# Altium schematic sheet Led.SchDoc
size B; SheetNumber: 1; SheetTotal: 1; SPICEModelCacheJMWTMJWM: <root> / <DocumentId>JMWTMJWM</DocumentId> / <CacheFrame Number="0"> / <Model Name="1206_150120ss75000" Kind="CKT"> / <Text>****** / .subckt 1206_150120SS75000  1  2 / D1 1 2 SMCW / .MODEL SMCW D / + IS=10.012E-21 / + N=1.7421 / + RS=1.0000E-6 / + IKF=.26961 / + CJO=1.0000E-12 / + M=.3333 / + VJ=.75 / + BV=5 / + IBV=10.00E-6 / + TT=5.0000E-9 / .ends</Text> / </Model> / </CacheFrame> / </root>
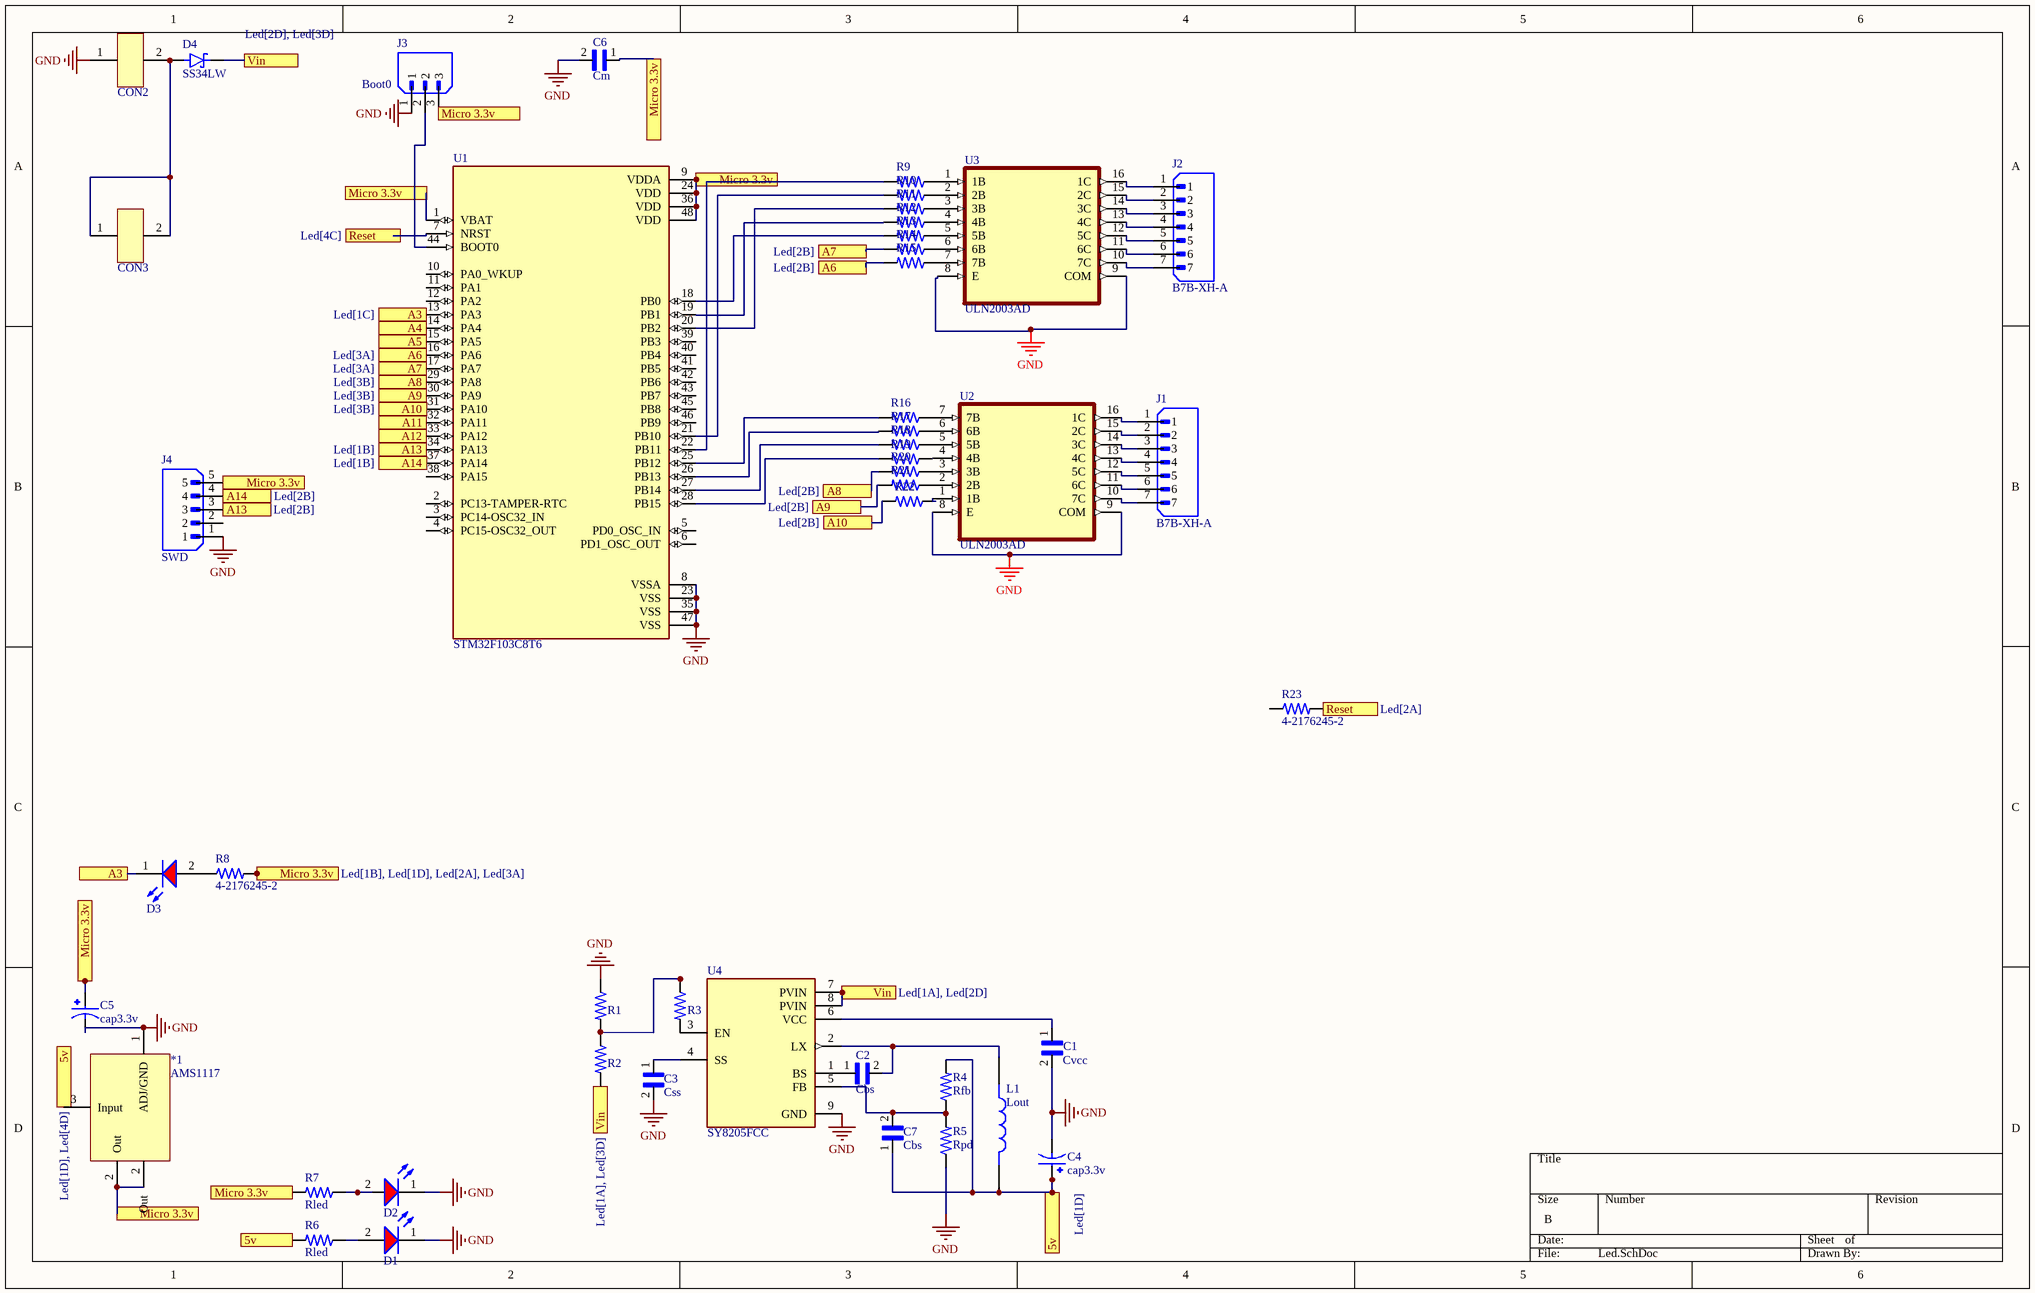
[diagram p0: Led.SchDoc]

## Parts
*1  AMS1117  [SOT229P700X180-4N]
C1  Cvcc  [CAP3216X125N]
C2  Cbs  [CAP3216X125N]
C3  Css  [CAP3216X125N]
C4  cap3.3v  [CAP_EEEFPA221XAL]
C5  cap3.3v  [CAP_EEEFPA221XAL]
C6  Cm  [CAP3216X125N]
C7  Cbs  [CAP3216X125N]
CON2  CON?  [PCBComponent_1]  (value not drawn)
CON3  CON?  [PCBComponent_1]  (value not drawn)
D1  Super Red, 1.9V, 140°  [WL-SMCW_1206_150120xx75000]  (value not drawn)
D2  Super Red, 1.9V, 140°  [WL-SMCW_1206_150120xx75000]  (value not drawn)
D3  Super Red, 1.9V, 140°  [WL-SMCW_1206_150120xx75000]  (value not drawn)
D4  SS34LW  [SODFL3718X102N]
J1  B7B-XH-A  [PCBComponent_1]
J2  B7B-XH-A  [PCBComponent_1]
J3  Boot0  [PCBComponent_1]
J4  SWD  [PCBComponent_1]
L1  Lout  [IND_LQH5BPB100MT0L]
R1  4-2176245-2  [RESC3115X65N]  (value not drawn)
R2  4-2176245-2  [RESC3115X65N]  (value not drawn)
R3  4-2176245-2  [RESC3115X65N]  (value not drawn)
R4  Rfb  [RESC3115X65N]
R5  Rpd  [RESC3115X65N]
R6  Rled  [RESC3115X65N]
R7  Rled  [RESC3115X65N]
R8  4-2176245-2  [RESC3115X65N]
R9  4-2176245-2  [PCBComponent_1]  (value not drawn)
R10  4-2176245-2  [PCBComponent_1]  (value not drawn)
R11  4-2176245-2  [PCBComponent_1]  (value not drawn)
R12  4-2176245-2  [PCBComponent_1]  (value not drawn)
R13  4-2176245-2  [PCBComponent_1]  (value not drawn)
R14  4-2176245-2  [PCBComponent_1]  (value not drawn)
R15  4-2176245-2  [PCBComponent_1]  (value not drawn)
R16  4-2176245-2  [PCBComponent_1]  (value not drawn)
R17  4-2176245-2  [PCBComponent_1]  (value not drawn)
R18  4-2176245-2  [PCBComponent_1]  (value not drawn)
R19  4-2176245-2  [PCBComponent_1]  (value not drawn)
R20  4-2176245-2  [PCBComponent_1]  (value not drawn)
R21  4-2176245-2  [PCBComponent_1]  (value not drawn)
R22  4-2176245-2  [PCBComponent_1]  (value not drawn)
R23  4-2176245-2  [PCBComponent_1]
U1  STM32F103C8T6  [QFP50P900X900X160-48N]
U2  ULN2003AD  [SOIC127P600X175-16N]
U3  ULN2003AD  [SOIC127P600X175-16N]
U4  SY8205FCC  [VREG_SY8205FCC]

## Ports
5v (see Led[1D]), 5v (see Led[1D], Led[4D]), A3 (see Led[1C]), A3 (see Led[2A]), A4, A5, A6 (see Led[2B]), A6 (see Led[3A]), A7 (see Led[2B]), A7 (see Led[3A]), A8 (see Led[2B]), A8 (see Led[3B]), A9 (see Led[2B]), A9 (see Led[3B]), A10 (see Led[2B]), A10 (see Led[3B]), A11, A12, A13 (see Led[1B]), A13 (see Led[2B]), A14 (see Led[1B]), A14 (see Led[2B]), Micro 3.3v (see Led[1B], Led[1C], Led[1D], Led[2A]), Micro 3.3v (see Led[1B], Led[1C], Led[1D], Led[2A], Led[3A]), Micro 3.3v (see Led[1B], Led[1D], Led[2A], Led[3A]), Micro 3.3v (see Led[1C], Led[1D], Led[2A], Led[3A]), Reset (see Led[2A]), Reset (see Led[4C]), Vin (see Led[1A], Led[2D]), Vin (see Led[1A], Led[3D]), Vin (see Led[2D], Led[3D])

## Nets
GND: *1.1(ADJ/GND) C1.2 C3.2 C4.2 C5.2 C6.2 CON2.1 D1.1(K) D2.1(K) J3.1 J4.1 R1.1 R5.1 U1.8(VSSA) U1.23(VSS) U1.35(VSS) U1.47(VSS) U2.8(E) U2.9(COM) U3.8(E) U3.9(COM) U4.9(GND)
5v: *1.3(Input) C4.1 C7.1 L1.2 R4.2 R6.2 ; port 5v
A3: D3.1(K) U1.13(PA3) ; port A3
A4: U1.14(PA4) ; port A4
A5: U1.15(PA5) ; port A5
A6: R15.2 U1.16(PA6) ; port A6
A7: R14.2 U1.17(PA7) ; port A7
A8: R20.2 U1.29(PA8) ; port A8
A9: R21.2 U1.30(PA9) ; port A9
A10: R22.2 U1.31(PA10) ; port A10
A11: U1.32(PA11) ; port A11
A12: U1.33(PA12) ; port A12
A13: J4.3 U1.34(PA13) ; port A13
A14: J4.4 U1.37(PA14) ; port A14
Micro 3.3v: *1.2(Out) C5.1 C6.1 J3.3 J4.5 R7.2 R8.2 U1.1(VBAT) U1.9(VDDA) U1.24(VDD) U1.36(VDD) U1.48(VDD) ; port Micro 3.3v
Reset: R23.2 U1.7(NRST) ; port Reset
Vin: D4.C(K) R2.2 U4.7(PVIN) U4.8(PVIN) ; port Vin
NetC1_1: C1.1 U4.6(VCC)
NetC2_1: C2.1 U4.1(BS)
NetC2_2: C2.2 L1.1 U4.2(LX)
NetC3_1: C3.1 U4.4(SS)
NetC7_2: C7.2 R4.1 R5.2 U4.5(FB)
NetCON2_2: CON2.2 CON3.1 CON3.2 D4.A
NetD1_2: D1.2(A) R6.1
NetD2_2: D2.2(A) R7.1
NetD3_2: D3.2(A) R8.1
NetJ1_1: J1.1 U2.16(1C)
NetJ1_2: J1.2 U2.15(2C)
NetJ1_3: J1.3 U2.14(3C)
NetJ1_4: J1.4 U2.13(4C)
NetJ1_5: J1.5 U2.12(5C)
NetJ1_6: J1.6 U2.11(6C)
NetJ1_7: J1.7 U2.10(7C)
NetJ2_1: J2.1 U3.16(1C)
NetJ2_2: J2.2 U3.15(2C)
NetJ2_3: J2.3 U3.14(3C)
NetJ2_4: J2.4 U3.13(4C)
NetJ2_5: J2.5 U3.12(5C)
NetJ2_6: J2.6 U3.11(6C)
NetJ2_7: J2.7 U3.10(7C)
NetJ3_2: J3.2 U1.44(BOOT0)
NetR1_2: R1.2 R2.1 R3.1
NetR3_2: R3.2 U4.3(EN)
NetR9_1: R9.1 U3.1(1B)
NetR9_2: R9.2 U1.22(PB11)
NetR10_1: R10.1 U3.2(2B)
NetR10_2: R10.2 U1.21(PB10)
NetR11_1: R11.1 U3.3(3B)
NetR11_2: R11.2 U1.20(PB2)
NetR12_1: R12.1 U3.4(4B)
NetR12_2: R12.2 U1.19(PB1)
NetR13_1: R13.1 U3.5(5B)
NetR13_2: R13.2 U1.18(PB0)
NetR14_1: R14.1 U3.6(6B)
NetR15_1: R15.1 U3.7(7B)
NetR16_1: R16.1 U2.7(7B)
NetR16_2: R16.2 U1.25(PB12)
NetR17_1: R17.1 U2.6(6B)
NetR17_2: R17.2 U1.26(PB13)
NetR18_1: R18.1 U2.5(5B)
NetR18_2: R18.2 U1.27(PB14)
NetR19_1: R19.1 U2.4(4B)
NetR19_2: R19.2 U1.28(PB15)
NetR20_1: R20.1 U2.3(3B)
NetR21_1: R21.1 U2.2(2B)
NetR22_1: R22.1 U2.1(1B)

Not connected (* = marked no-connect by the designer): J4 2; R23 1; U1 2(PC13-TAMPER-RTC) 3(PC14-OSC32_IN) 4(PC15-OSC32_OUT) 5(PD0_OSC_IN) 6(PD1_OSC_OUT) 10(PA0_WKUP) 11(PA1) 12(PA2) 38(PA15) 39(PB3) 40(PB4) 41(PB5) 42(PB6) 43(PB7) 45(PB8) 46(PB9)

## Library data of the parts
C1-C3 C6 C7 = GRM31CR71H475KA12L: CAP 4.7UF 50VDC X7R 10% SMD 1206; MP: GRM31CR71H475KA12L; Availability: Unavailable; Package: None; Price: None; Value: *
C4 C5 = EEEFPA221XAL: Aluminum Electrolytic Capacitors - SMD 10VDC 220uF 20% 6x8mm AEC-Q200; MP: EEE-FPA221XAL; MF: Panasonic; Availability: In Stock; Price: None; Package: RADIAL-2 Panasonic; Value: *; SnapEDA_Link: https://www.snapeda.com/parts/EEE-FPA221XAL/Panasonic/view-part/6178333/?ref=snap; Check_prices: https://www.snapeda.com/parts/EEE-FPA221XAL/Panasonic/view-part/6178333/?ref=eda; Purchase-URL: https://pricing.snapeda.com/search/part/EEE-FPA221XAL/?ref=eda
D1-D3 = 150120SS75000: WL-SMCW Mono-color Chip LED Waterclear, SMT, size 1206, Super Red, 1.9V, 140°; Manufacturer: Wurth Elektronik; Case/Size Code: 1206; Chip Technology: AlInGaP; Dominant Wavelength: 630nm; Luminous Intensity: 60mcd; Peak Wavelength: 645nm; Manufacturer Part Number: 150120SS75000; Category: Signal LEDs; Match Code: WL-SMCW; ComponentLink1Description: Website Link; ComponentLink1URL: https://www.we-online.com/redexpert/article/150120SS75000?ad; ComponentLink2Description: Datasheet Link; ComponentLink2URL: https://www.we-online.com/redexpert/spec/150120SS75000?ad; Mount: Surface Mount; Operating Temperature Max: 85°C; Operating Temperature Min: -40°C; Packaging: Tape and Reel; Length: 3.2mm; Width: 1.6mm; Height: 0.68mm; Emitting Color: Super Red; Forward Voltage: 1.9V; Viewing Angle: 140°
D4 = SS34LW: 3A, 40V, Schottky Rectifier; MF: Taiwan Semiconductor; Value: *; Check_prices: https://www.snapeda.com/parts/SS34LW/Taiwan+Semiconductor/view-part/?ref=eda; MP: SS34LW; Package: SOD-123W-2 Taiwan Semiconductor; Availability: In Stock; Price: None; SnapEDA_Link: https://www.snapeda.com/parts/SS34LW/Taiwan+Semiconductor/view-part/?ref=snap; Purchase-URL: https://pricing.snapeda.com/search/part/SS34LW/?ref=eda
J1 J2 = B7B-XH-A: Connector Header Through Hole 7 position 0.098 (2.50mm); MF: JST Sales; SnapEDA_Link: https://www.snapeda.com/parts/B7B-XH-A/JST+Sales+America+Inc./view-part/?ref=snap; Package: None; Value: *; MP: B7B-XH-A; Check_prices: https://www.snapeda.com/parts/B7B-XH-A/JST+Sales+America+Inc./view-part/?ref=eda
J3 = B3B-XH-A: Connector Header Through Hole 3 position 0.098 (2.50mm); MF: JST Sales; SnapEDA_Link: https://www.snapeda.com/parts/B3B-XH-A/JST+Sales+America+Inc./view-part/?ref=snap; Package: None; Value: *; MP: B3B-XH-A; Check_prices: https://www.snapeda.com/parts/B3B-XH-A/JST+Sales+America+Inc./view-part/?ref=eda
J4 = B5B-XH-A: Connector Header Through Hole 5 position 0.098 (2.50mm); MF: JST Sales; SnapEDA_Link: https://www.snapeda.com/parts/B5B-XH-A/JST+Sales+America+Inc./view-part/?ref=snap; Package: None; Value: *; MP: B5B-XH-A; Check_prices: https://www.snapeda.com/parts/B5B-XH-A/JST+Sales+America+Inc./view-part/?ref=eda
L1 = LQH5BPB100MT0L: Inductor with Inductance: 10uH Tol. +/-20%, Package: 2020 (5050); MF: Murata; Package: NONSTANDARD; MP: LQH5BPB100MT0L; Check_prices: https://www.snapeda.com/parts/LQH5BPB100MT0L/Murata/view-part/4547622/?ref=eda; Value: *; SnapEDA_Link: https://www.snapeda.com/parts/LQH5BPB100MT0L/Murata/view-part/4547622/?ref=snap; Digi-Key_Part_Number: 490-9930-1-ND; Purchase-URL: https://pricing.snapeda.com/search/part/LQH5BPB100MT0L/?ref=eda
R1-R4 R6-R23 = 4-2176245-2: CRGS1206 5% 2K7; Package: None; Price: None; Value: *; MP: 4-2176245-2; Availability: Unavailable
R5 = 4-2176245-2: Package: None; Price: None; Value: *; MP: 4-2176245-2; Availability: Unavailable
U1 = STM32F103C8T6: ARM® Cortex®-M3 STM32F1 Microcontroller IC 32-Bit 72MHz 64KB (64K x 8) FLASH 48-LQFP (7x7); MF: STMicroelectronics; SnapEDA_Link: https://www.snapeda.com/parts/STM32F103C8T6/STMicroelectronics/view-part/?ref=snap; Package: LQFP-48 STMicroelectronics; Value: *; MP: STM32F103C8T6; Check_prices: https://www.snapeda.com/parts/STM32F103C8T6/STMicroelectronics/view-part/?ref=eda
U2 U3 = ULN2003AD: 50-V, 7-ch darlington transistor array, -20C to 70C; MF: Texas Instruments; Check_prices: https://www.snapeda.com/parts/ULN2003AD/Texas+Instruments/view-part/?ref=eda; SnapEDA_Link: https://www.snapeda.com/parts/ULN2003AD/Texas+Instruments/view-part/?ref=snap; Price: None; Availability: In Stock; Value: *; MP: ULN2003AD; Package: SOIC-16 Texas Instruments; Purchase-URL: https://pricing.snapeda.com/search/part/ULN2003AD/?ref=eda
U4 = SY8205FCC: High-Efficiency Fast Responseï¼Œ5A, 30V Input Synchronous Step Down Regulator; MF: Silergy; SnapEDA_Link: https://www.snapeda.com/parts/SY8205FCC/Silergy/view-part/?ref=snap; Package: Package; Value: *; MP: SY8205FCC; Check_prices: https://www.snapeda.com/parts/SY8205FCC/Silergy/view-part/?ref=eda